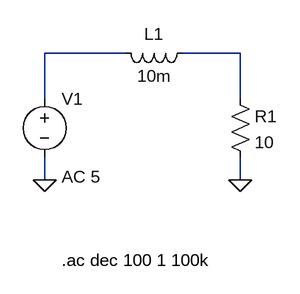
[diagram p0: schematic basic_coil.asc]
basic_coil.asc, the LTspice schematic file:
Version 4
SHEET 1 880 680
WIRE 192 48 80 48
WIRE 352 48 272 48
WIRE 80 112 80 48
WIRE 352 112 352 48
WIRE 80 224 80 192
WIRE 352 224 352 192
FLAG 352 224 0
FLAG 80 224 0
SYMBOL voltage 80 96 R0
WINDOW 123 24 124 Left 2
WINDOW 39 0 0 Left 2
SYMATTR InstName V1
SYMATTR Value ""
SYMATTR Value2 AC 5
SYMBOL res 336 96 R0
SYMATTR InstName R1
SYMATTR Value 10
SYMBOL ind 288 32 R90
WINDOW 0 5 56 VBottom 2
WINDOW 3 32 56 VTop 2
SYMATTR InstName L1
SYMATTR Value 10m
TEXT 104 336 Left 2 !.ac dec 100 1 100k

The netlist it stands for:
* basic_coil.asc
V1 N001 0 AC 5
R1 N002 0 10
L1 N002 N001 10m
.ac dec 100 1 100k
.backanno
.end